# Altium schematic sheet Analog_readout.SchDoc: SiPM - S10985
size A4; Author: Rigoberto Chil; CompanyName: LIM - HGGM; DrawnBy: RCP; Engineer: RCP; DocumentName: SiPM - S10985
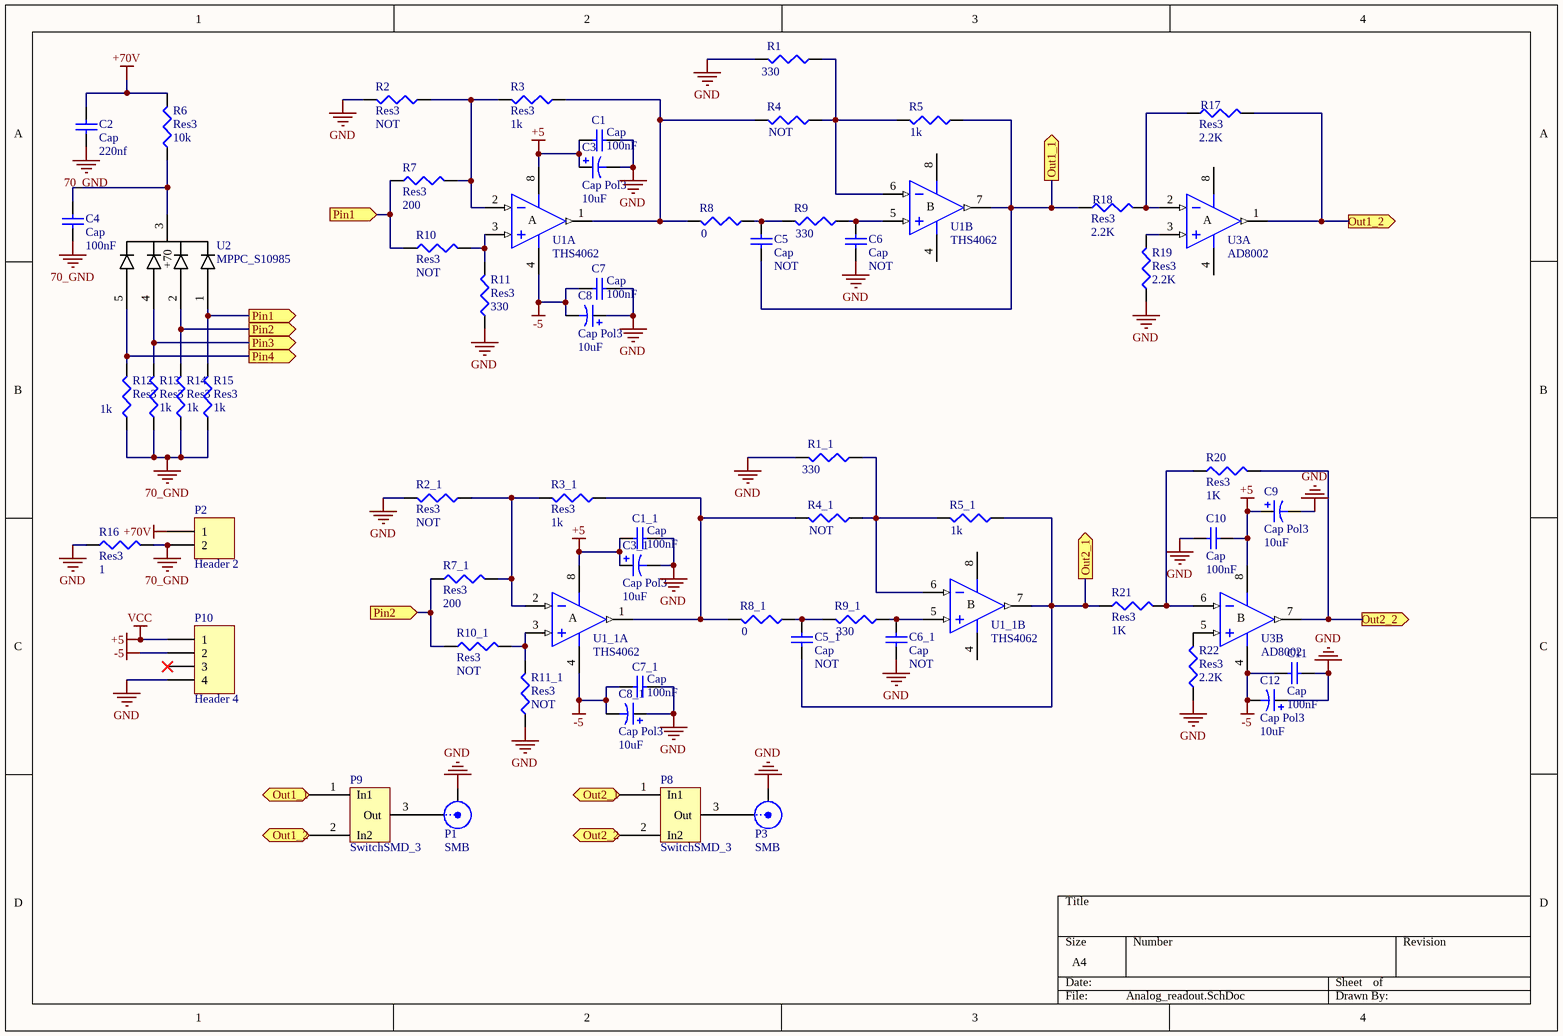
[diagram p0: Analog_readout.SchDoc]

## Parts
C1  Cap  value 100nF  [6-0805_N]
C1_1  Cap  value 100nF  [6-0805_N]
C2  Cap  value 220nf  [6-0805_N]
C3  Cap Pol3  value 10uF  [6-0805_N]
C3_1  Cap Pol3  value 10uF  [6-0805_N]
C4  Cap  value 100nF  [6-0805_N]
C5  Cap  value NOT  [6-0805_N]
C5_1  Cap  value NOT  [6-0805_N]
C6  Cap  value NOT  [6-0805_N]
C6_1  Cap  value NOT  [6-0805_N]
C7  Cap  value 100nF  [6-0805_N]
C7_1  Cap  value 100nF  [6-0805_N]
C8  Cap Pol3  value 10uF  [6-0805_N]
C8_1  Cap Pol3  value 10uF  [6-0805_N]
C9  Cap Pol3  value 10uF  [6-0805_N]
C10  Cap  value 100nF  [6-0805_N]
C11  Cap  value 100nF  [6-0805_N]
C12  Cap Pol3  value 10uF  [6-0805_N]
P1  SMB  [SMB_V-RJ45]
P2  Header 2  [HDR1X2]
P3  SMB  [SMB_V-RJ45]
P8  SwitchSMD_3  [SwitchSMD_0603]
P9  SwitchSMD_3  [SwitchSMD_0603]
P10  Header 4  [HDR1X4]
R1  value 330  [6-0805_N]  (hidden comment: Res3)
R1_1  value 330  [6-0805_N]  (hidden comment: Res3)
R2  Res3  value NOT  [6-0805_N]
R2_1  Res3  value NOT  [6-0805_N]
R3  Res3  value 1k  [6-0805_N]
R3_1  Res3  value 1k  [6-0805_N]
R4  value NOT  [6-0805_N]  (hidden comment: Res3)
R4_1  value NOT  [6-0805_N]  (hidden comment: Res3)
R5  value 1k  [6-0805_N]  (hidden comment: Res3)
R5_1  value 1k  [6-0805_N]  (hidden comment: Res3)
R6  Res3  value 10k  [6-0805_N]
R7  Res3  value 200  [6-0805_N]
R7_1  Res3  value 200  [6-0805_N]
R8  value 0  [6-0805_N]  (hidden comment: Res3)
R8_1  value 0  [6-0805_N]  (hidden comment: Res3)
R9  value 330  [6-0805_N]  (hidden comment: Res3)
R9_1  value 330  [6-0805_N]  (hidden comment: Res3)
R10  Res3  value NOT  [6-0805_N]
R10_1  Res3  value NOT  [6-0805_N]
R11  Res3  value 330  [6-0805_N]
R11_1  Res3  value NOT  [6-0805_N]
R12  Res3  value 1k  [6-0805_N]
R13  Res3  value 1k  [6-0805_N]
R14  Res3  value 1k  [6-0805_N]
R15  Res3  value 1k  [6-0805_N]
R16  Res3  value 1  [6-0805_N]
R17  Res3  value 2.2K  [6-0805_N]
R18  Res3  value 2.2K  [6-0805_N]
R19  Res3  value 2.2K  [6-0805_N]
R20  Res3  value 1K  [6-0805_N]
R21  Res3  value 1K  [6-0805_N]
R22  Res3  value 2.2K  [6-0805_N]
U1  THS4062  [SO-8_M]  (parts A,B of 2)
U1_1  THS4062  [SO-8_M]  (parts A,B of 2)
U2  MPPC_S10985  [S10985_HAM]
U3  AD8002  [SO-8_M]  (parts A,B of 2)

## Ports
Out1_1 (out), Out1_2 (out), Out2_1 (out), Out2_2 (out), Pin1 (in), Pin1 (out), Pin2 (in), Pin2 (out), Pin3 (out), Pin4 (out)

## Nets
70_GND: C2.1 C4.1 P2.2 R12.1 R13.1 R14.1 R15.1 R16.2
+5: C1.2 C1_1.2 C3.1 C3_1.1 C9.1 C10.2 P10.1 U1.8(V+) U1_1.8(V+) U3.8(V+)  [also labelled VCC]
+70V: C2.2 P2.1 R6.2
-5: C7.2 C7_1.2 C8.2 C8_1.2 C11.1 C12.2 P10.2 U1.4(V-) U1_1.4(V-) U3.4(V-)
GND: C1.1 C1_1.1 C3.2 C3_1.2 C6.2 C6_1.2 C7.1 C7_1.1 C8.1 C8_1.1 C9.2 C10.1 C11.2 C12.1 P1.2(Y) P3.2(Y) P10.4 R1.2 R1_1.2 R2.2 R2_1.2 R11.1 R11_1.1 R16.1 R19.1 R22.1
Out1_1: C5.2 P9.1(In1) R5.1 R18.1 U1.7(OUT) ; port Out1_1
Out1_2: P9.2(In2) R17.2 U3.1(OUT) ; port Out1_2
Out2_1: C5_1.2 P8.1(In1) R5_1.1 R21.1 U1_1.7(OUT) ; port Out2_1
Out2_2: P8.2(In2) R20.2 U3.7(OUT) ; port Out2_2
Pin1: R7.1 R10.1 R15.2 U2.1(Pin1) ; port Pin1
Pin2: R7_1.1 R10_1.1 R14.2 U2.2(Pin2) ; port Pin2
Pin3: R13.2 U2.4 ; port Pin3
Pin4: R12.2 U2.5 ; port Pin4
NetC4_2: C4.2 R6.1 U2.3(+70)
NetC5_1: C5.1 R8.1 R9.2
NetC5_1_1: C5_1.1 R8_1.1 R9_1.2
NetC6_1: C6.1 R9.1 U1.5(IN+)
NetC6_1_1: C6_1.1 R9_1.1 U1_1.5(IN+)
NetP1_1: P1.1(X) P9.3(Out)
NetP3_1: P3.1(X) P8.3(Out)
NetR1_1: R1.1 R4.1 R5.2 U1.6(IN-)
NetR1_1_1: R1_1.1 R4_1.1 R5_1.2 U1_1.6(IN-)
NetR2_1: R2.1 R3.2 R7.2 U1.2(IN-)
NetR2_1_1: R2_1.1 R3_1.2 R7_1.2 U1_1.2(IN-)
NetR3_1: R3.1 R4.2 R8.2 U1.1(OUT)
NetR3_1_1: R3_1.1 R4_1.2 R8_1.2 U1_1.1(OUT)
NetR10_1_2: R10_1.2 R11_1.2 U1_1.3(IN+)
NetR10_2: R10.2 R11.2 U1.3(IN+)
NetR17_1: R17.1 R18.2 U3.2(IN-)
NetR19_2: R19.2 U3.3(IN+)
NetR20_1: R20.1 R21.2 U3.6(IN-)
NetR22_2: R22.2 U3.5(IN+)

Not connected (* = marked no-connect by the designer): P10 3*

## Notes on the sheet
- (in symbol AD8002AR, part A) A
- (in symbol AD8002AR, part B) B

## Library data of the parts
C1 C1_1 C2 C4 C5 C5_1 C6 C6_1 C7 C7_1 C10 C11 = Cap: Capacitor; Published: 8-Jun-2000; LatestRevisionDate: 17-Jul-2002; LatestRevisionNote: Re-released for DXP Platform.; PackageReference: RAD-0.3; Publisher: Altium Limited; PackageDescription: Radial Cap, Thru-Hole; 2 Leads; 0.3 in Pin Spacing
C3 C3_1 C8 C8_1 C9 C12 = Cap Pol3: Polarized Capacitor (Surface Mount); Published: 8-Jun-2000; LatestRevisionDate: 29-May-2009; LatestRevisionNote: IPC-7351 Footprint Added.; PackageReference: C0805; Publisher: Altium Limited; PackageDescription: Chip Capacitor
P1 P3 = SMB: SMB Straight Connector; LatestRevisionDate: 17-Jul-2002; LatestRevisionNote: Re-released for DXP Platform.; Publisher: Altium Limited
P2 = Header 2: Header, 2-Pin; LatestRevisionDate: 17-Jul-2002; LatestRevisionNote: Re-released for DXP Platform.; Publisher: Altium Limited
P10 = Header 4: Header, 4-Pin; LatestRevisionDate: 17-Jul-2002; LatestRevisionNote: Re-released for DXP Platform.; Publisher: Altium Limited
R1 R1_1 R2 R2_1 R3 R3_1 R4 R4_1 R5 R5_1 R6 R7 R7_1 R8 R8_1 R9 R9_1 R10 R10_1 R11 R11_1 R12-R22 = Res3: Resistor; Published: 8-Jun-2000; LatestRevisionDate: 29-May-2009; LatestRevisionNote: IPC-7351 Footprint Added.; PackageReference: J1-0603; Publisher: Altium Limited; PackageDescription: Chip Resistor
U1 U1_1 U3 = AD8002AR: Dual 600MHz, 50mW Current Feedback Amplifier; Published: 8-Jun-2000; LatestRevisionDate: 13-Apr-2006; LatestRevisionNote: IPC-7351 Footprint Added.; DatasheetVersion: REV. C 1999; PackageVersion: revA; PackageReference: SO-8; Publisher: Altium Limited; PackageDescription: 8-Pin Small Outline Integrated Circuit 1.27 mm Pitch; Code_JEDEC: MS-012-AA; Code_IPC: SOIC127P600-8; ComponentLink1Description: Manufacturer Link; ComponentLink1URL: http://www.analog.com/en/prod/0,,759_786_AD8002%2C00.html; ComponentLink2Description: Datasheet; ComponentLink2URL: http://www.analog.com/UploadedFiles/Data_Sheets/147523773AD8002_d.pdf